# EAGLE design Display-KeyboardModule (EAGLE 9.6.2)
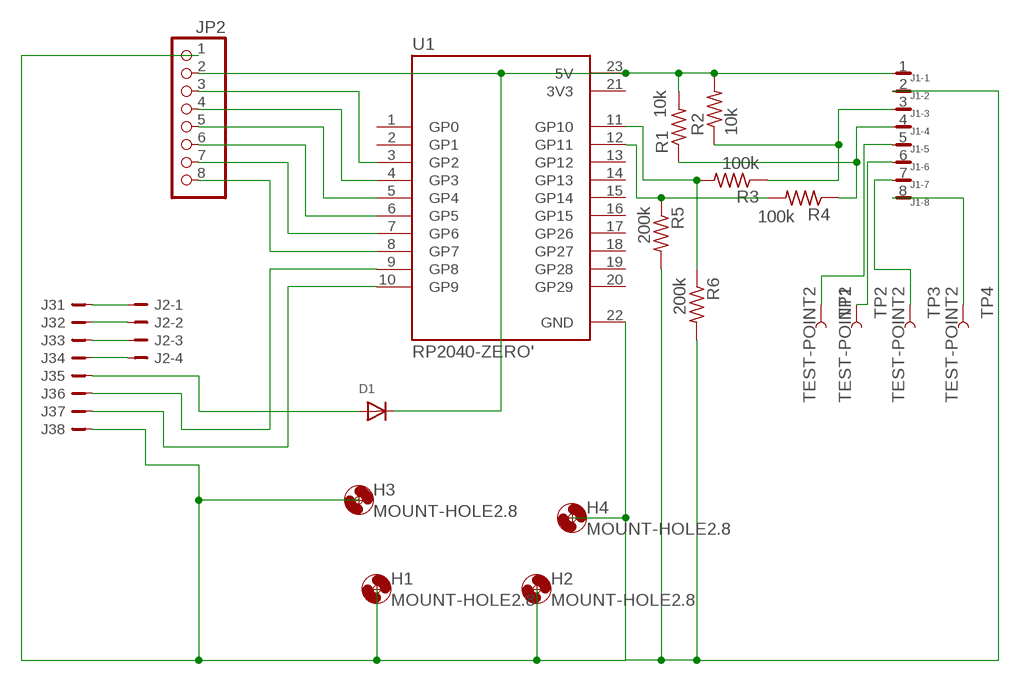
[diagram p0: schematic, sheet 1]

## Parts
D1  DIODESMA  [SMADIODE]
H1  MOUNT-HOLE2.8  [2,8]
H2  MOUNT-HOLE2.8  [2,8]
H3  MOUNT-HOLE2.8  [2,8]
H4  MOUNT-HOLE2.8  [2,8]
J1  JST-SH-8_RA  [SM08B-SRSS-TB]
J2  JST-PH-4_TH-RA  [S4B-PH-KL]
J3  B8B-PH-K-S  [B8B-PH-K-S]
JP2  PINHD-1X8/90  [1X08/90]
R1  10k  R-US_R1206  [R1206]
R2  10k  R-US_R1206  [R1206]
R3  100k  R-US_R1206  [R1206]
R4  100k  R-US_R1206  [R1206]
R5  200k  R-US_R1206  [R1206]
R6  200k  R-US_R1206  [R1206]
TP1  TEST-POINT2  [PAD.02X.02]
TP2  TEST-POINT2  [PAD.02X.02]
TP3  TEST-POINT2  [PAD.02X.02]
TP4  TEST-POINT2  [PAD.02X.02]
U1  RP2040-ZERO'  [MODULE_RP2040-ZERO]

## Nets
GND: J1.2 J3.8 JP2.1 R5.2 R6.2 U1.22(GND)
N$1: D1.A J3.5
N$2: J2.1 J3.1
N$3: JP2.3 U1.3(GP2)
N$4: J3.6 U1.9(GP8)
N$5: J3.7 U1.10(GP9)
N$6: JP2.4 U1.4(GP3)
N$7: JP2.5 U1.5(GP4)
N$8: JP2.6 U1.6(GP5)
N$9: JP2.7 U1.7(GP6)
N$10: JP2.8 U1.8(GP7)
N$11: D1.C J1.1 JP2.2 R1.2 R2.2 U1.23(5V)
N$12: J1.3 R2.1 R3.1
N$13: J2.2 J3.2
N$14: J1.8 TP4.1
N$15: J1.7 TP3.1
N$16: J1.6 TP2.1
N$17: J1.4 R1.1 R4.1
N$18: J1.5 TP1.1
N$19: R4.2 R5.1 U1.12(GP11)
N$20: R3.2 R6.1 U1.11(GP10)
N$21: J2.3 J3.3
N$22: J2.4 J3.4
Unconnected: J1.M1 J1.M2 U1.1(GP0) U1.2(GP1) U1.13(GP12) U1.14(GP13) U1.15(GP14) U1.16(GP15) U1.17(GP26) U1.18(GP27) U1.19(GP28) U1.20(GP29)

## Power pins joined to a net without a drawn wire
3V3: U1.21(3V3)

## Library data of the parts
D1 = adafruit:DIODE: Diode SMADIODE - SMA Surface Mount Package 20V 1A Schottky Diode Digikey: 641-1014-6-ND DO-1N4148 - Through Hole Small Current Diode SOD-123 20V 1 A (.5mV Vf) Schottky Diode - Digikey: MBRX120TPMSCT-ND SOD-323 10V 570mA (.38mV Vf, 3ns) Schottky Diode - Digikey: ZLLS410CT-ND SOD-523 30V 30mA Schottky Diode (RB751S-40TE61) - Digikey: RB751S-40TE61CT-ND SOT23-R/W - SOT23 Package (R = Solder Paste/Reflow Ovens, W = Hand-Soldering) BAT54Film 40V 300mA - Digikey: 497-7162-1-ND
H1-H4 = holes:MOUNT-HOLE: MOUNTING HOLE with drill center marker
J1 = con-JST-SH:JST-SH-8; MF: JST; MPN: SM08B-SRSS-TB
J2 = con-JST-PH:JST-PH-4; MF: JST; MPN: S4B-PH-KL
J3 = con-JST-PH:B8B-PH-K-S: JST-PH 8-way vertical TH
JP2 = pinhead:PINHD-1X8: PIN HEADER
R1-R6 = adafruit:R-US_: RESISTOR, American symbol
TP1-TP4 = SparkFun-Connectors:TEST-POINT: SparkFun Test Points Bare copper test points for troubleshooting or In-Circuit-Testing. These are used by our Production team for verifying production board runs using pogo-pins on test beds. SparkFun Products: SparkFun LSM9DS1 Breakout <https://www.sparkfun.com/products/13284> SparkFun PSOC <https://www.sparkfun.com/products/13714> SparkFun Load Cell Amplifier <https://www.sparkfun.com/products/13879>
U1 = RP2040-ZERO:RP2040-ZERO: Check availability <https://pricing.snapeda.com/parts/RP2040-ZERO/Waveshare%20Electronics/view-part?ref=eda>; AVAILABILITY: Not in stock; CHECK_PRICES: https://www.snapeda.com/parts/RP2040-ZERO/Waveshare+Electronics/view-part/?ref=eda; DESCRIPTION: Low-Cost, High-Performance Pico-Like MCU Board Based On Raspberry Pi Microcontroller RP2040; MF: Waveshare Electronics; MP: RP2040-ZERO; PACKAGE: Package; PRICE: None; SNAPEDA_LINK: https://www.snapeda.com/parts/RP2040-ZERO/Waveshare+Electronics/view-part/?ref=snap

## Board
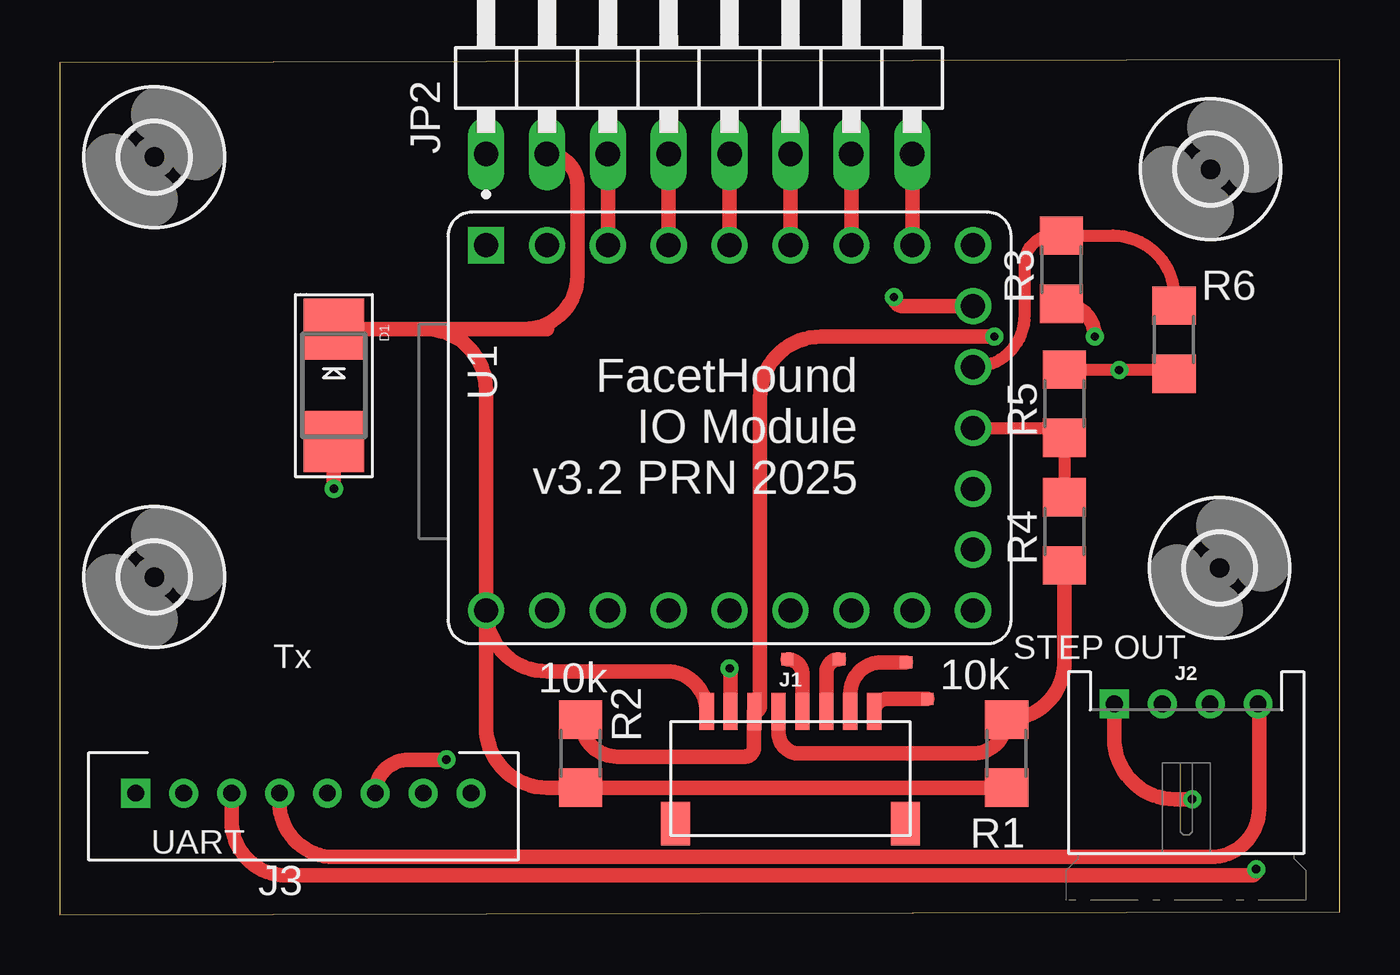
[diagram p1: board, top side]
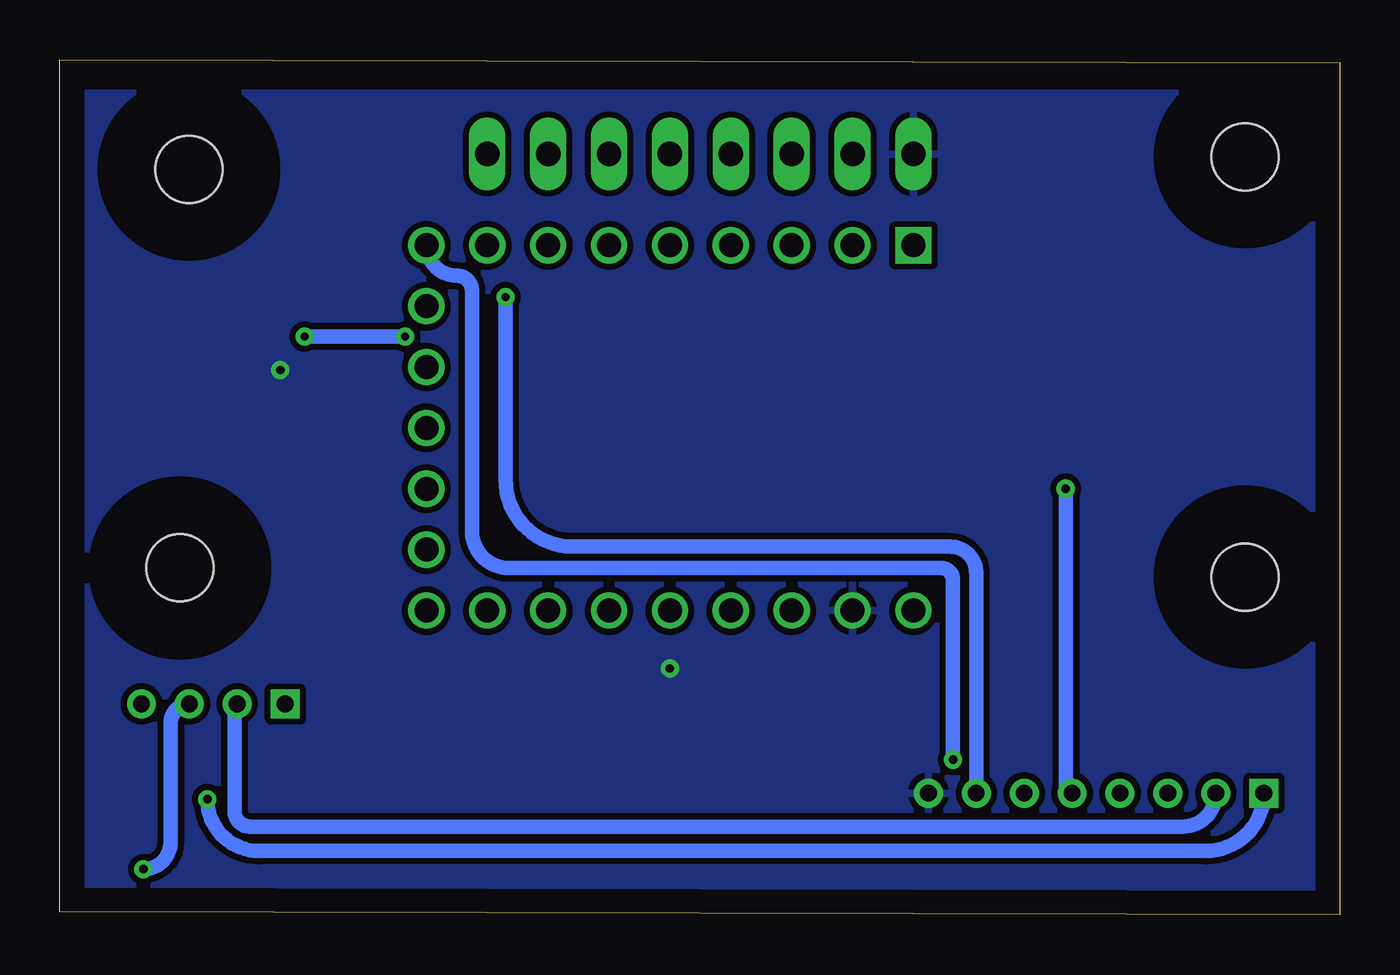
[diagram p2: board, bottom side, seen from below]

Size 53.39 x 35.68 mm. Coordinates in mm from the lower left corner, seen from the top.
Outline: 0,0 53.39,0.13 53.39,35.68 0,35.55 0,0
Copper layers (1*16): Top 0.035mm / dielectric 1.5mm / Bottom 0.035mm
Design rules "default": minimum track width 6mil, minimum drill 0.35mm, track to track 6mil, track to pad 6mil, pad to pad 6mil, via to via 6mil, smd to smd 6mil, copper to edge 40mil, drill to drill 6mil, minimum pad ring 10mil, minimum via ring 8mil, stop-mask expansion 4mil, vias tented up to drill 0mil, thermal gap 10mil

### Footprints (pad centres in the part's own frame; a part is rotated, then mirrored left to right if it is on the bottom)
SMADIODE = smd 2.54 x 2.54: A 2.349,0; C -2.349,0
2,8 = hole 2.8: 0,0
SM08B-SRSS-TB = smd 0.6 x 1.55: 1 -3.5,4.675; 2 -2.5,4.675; 3 -1.5,4.675; 4 -0.5,4.675; 5 0.5,4.675; 6 1.5,4.675; 7 2.5,4.675; 8 3.5,4.675 | smd 1.2 x 1.8: M1 4.8,0; M2 -4.8,0
S4B-PH-KL = drill 0.7 square: 1 3,-3.72 | drill 0.7: 2 1,-3.72; 3 -1,-3.72; 4 -3,-3.72
B8B-PH-K-S = drill 0.7 square: 1 7,0 | drill 0.7: 2 5,0; 3 3,0; 4 1,0; 5 -1,0; 6 -3,0; 7 -5,0; 8 -7,0
1X08/90 = drill 1.016 long: 1 -8.89,-3.81; 2 -6.35,-3.81; 3 -3.81,-3.81; 4 -1.27,-3.81; 5 1.27,-3.81; 6 3.81,-3.81; 7 6.35,-3.81; 8 8.89,-3.81
R1206 = smd 1.6 x 1.803: 1 -1.422,0; 2 1.422,0
PAD.02X.02 = smd 0.508 x 0.508: 1 0,0
MODULE_RP2040-ZERO = drill 1 square: 1 7.62,10.16 | drill 1: 2 7.62,7.62; 3 7.62,5.08; 4 7.62,2.54; 5 7.62,0; 6 7.62,-2.54; 7 7.62,-5.08; 8 7.62,-7.62; 9 7.62,-10.16; 10 5.08,-10.16; 11 2.54,-10.16; 12 0,-10.16; 13 -2.54,-10.16; 14 -5.08,-10.16; 15 -7.62,-10.16; 16 -7.62,-7.62; 17 -7.62,-5.08; 18 -7.62,-2.54; 19 -7.62,0; 20 -7.62,2.54; 21 -7.62,5.08; 22 -7.62,7.62; 23 -7.62,10.16

### Placement (x,y rotation side)
D1  11.43,22.1 270 top
H1  3.94,14.1 0 top
H2  3.94,31.62 0 top
H3  48.39,14.48 0 top
H4  48.01,31.11 0 top
J1  30.48,3.81 0 top
J2  46.99,5.08 180 top
J3  10.16,5.08 180 top
JP2  26.67,35.56 0 top
R1  39.5,6.73 270 top
R2  21.72,6.73 270 top
R3  41.78,26.92 90 top
R4  41.91,16 90 top
R5  41.91,21.34 90 top
R6  46.48,24 270 top
TP1  30.35,10.67 0 top
TP2  32.51,10.67 0 top
TP3  35.31,10.54 0 top
TP4  36.2,9.02 0 top
U1  27.94,20.32 90 top

### Tracks (layer width: path | path; a pad name or v marks a point on that pad's centre or on a via)
GND  (via drill 0.35)
  Top 0.508: R5.2 44.17,22.76 arc-90 v44.2,22.73 46.33,22.73 arc-90 R6.2
  Top 0.61: J1.2 27.98,10.25 arc90 v27.94,10.29
  pour Bottom (isolate 0.254): 0.13,34.29 0.13,0 52.58,0 52.58,34.29
N$1  (via drill 0.35)
  Top 0.61: D1.A v11.43,17.78
  Bottom 0.61: J3.5 arc90 11.43,5.35 v11.43,17.78
N$2  (via drill 0.35)
  Top 0.61: v47.24,4.83 46.53,4.83 arc-90 43.99,7.37 J2.1
  Bottom 0.61: J3.1 arc90 5.57,2.67 45.08,2.67 arc90 v47.24,4.83
N$3
  Top 0.61: U1.3 JP2.3
N$4  (via drill 0.35)
  Top 0.61: v16.13,6.48 14.56,6.48 arc90 J3.6
  Bottom 0.61: U1.9 arc-90 36.83,26.67 arc90 36.2,26.04 36.2,16 arc-90 34.67,14.48 16.64,14.48 arc90 16.13,13.97 v16.13,6.48
N$5  (via drill 0.35)
  Top 0.61: v34.8,25.78 arc90 35.18,25.4 U1.10
  Bottom 0.61: v34.8,25.78 34.8,18.16 arc-90 32,15.37 16.26,15.37 arc90 15.16,14.27 J3.7
N$6
  Top 0.61: U1.4 JP2.4
N$7
  Top 0.61: U1.5 JP2.5
N$8
  Top 0.61: U1.6 JP2.6
N$9
  Top 0.61: U1.7 JP2.7
N$10
  Top 0.61: U1.8 JP2.8
N$11
  Top 0.61: 19.37,24.45 arc90 21.59,26.67 21.59,30.48 arc90 JP2.2 | U1.23 17.78,21.91 arc90 15.24,24.45 | 19.37,24.45 20.32,24.45 | D1.C 15.24,24.45 | 15.24,24.45 19.37,24.45 | R1.2 R2.2 20.32,5.31 arc-90 17.78,7.85 U1.23 | U1.23 arc90 20.32,10.16 25.3,10.16 arc-90 J1.1
N$12  (via drill 0.35)
  Top 0.61: 28.96,8.46 arc-90 J1.3 | R2.1 arc90 23.27,6.6 28.57,6.6 arc90 28.96,6.99 28.96,8.46 | 28.96,8.46 arc-90 J1.3 | J1.3 arc90 29.21,8.71 29.21,21.59 arc-90 31.75,24.13 v38.99,24.13 | v43.18,24.13 arc90 41.81,25.5 R3.1
  Bottom 0.61: v38.99,24.13 v43.18,24.13
N$13
  Bottom 0.61: J3.2 arc90 6.56,3.68 45.47,3.68 arc90 46.1,4.32 46.1,8.69 arc90 J2.2
N$14
  Top 0.61: J1.8 arc-90 34.51,9.02 TP4.1
N$15
  Top 0.61: TP3.1 34.29,10.54 arc90 32.98,9.23 J1.7
N$16
  Top 0.61: TP2.1 arc90 31.98,10.14 J1.6
N$17
  Top 0.61: J1.4 29.98,7.61 arc90 30.86,6.73 38.07,6.73 arc90 R1.1 arc90 41.91,10.57 R4.1
N$18
  Top 0.61: TP1.1 arc-90 30.98,10.04 J1.5
N$19
  Top 0.508: U1.12 41.5,20.32 arc-90 R5.1 R4.2
N$20
  Top 0.508: U1.11 arc90 40.26,25.02 40.26,27.18 arc-90 41.43,28.35 R3.2 43.94,28.35 arc-90 46.48,25.81 R6.1
N$21  (via drill 0.35)
  Top 0.61: J3.3 7.16,3.94 arc90 9.45,1.65 49.78,1.65 49.91,1.78 arc90 v49.91,1.91
  Bottom 0.61: J2.3 arc-90 48.77,8.02 48.77,3.05 arc90 v49.91,1.91
N$22
  Top 0.61: J3.4 9.16,4.7 arc90 11.45,2.41 48.01,2.41 arc90 50.04,4.45 50.04,8.75 arc90 J2.4

### Text on the board
tPlace: FacetHound / IO Module / v3.2 PRN 2025
tNames: STEP OUT | Tx | UART